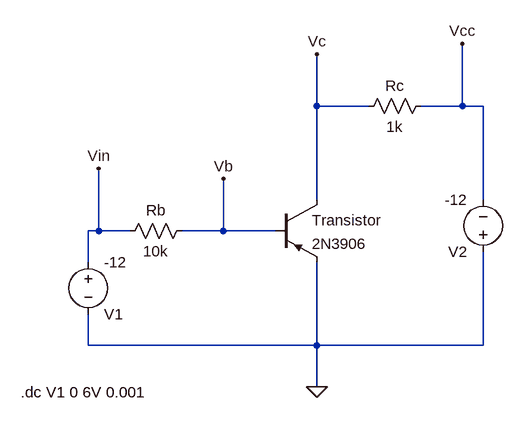
[diagram p0: schematic LED15mAPNP.asc]
LED15mAPNP.asc, the LTspice schematic file:
Version 4
SHEET 1 880 680
WIRE 48 -48 48 -128
WIRE 128 -48 48 -48
WIRE 272 -48 272 -144
WIRE 272 -48 208 -48
WIRE 304 -48 272 -48
WIRE 48 96 48 -48
WIRE 304 96 304 -48
WIRE -288 144 -288 48
WIRE -288 144 -304 144
WIRE -240 144 -288 144
WIRE -96 144 -96 64
WIRE -96 144 -160 144
WIRE -16 144 -96 144
WIRE -304 192 -304 144
WIRE -304 320 -304 272
WIRE 48 320 48 192
WIRE 48 320 -304 320
WIRE 304 320 304 176
WIRE 304 320 48 320
WIRE 48 384 48 320
FLAG 48 384 0
FLAG 48 -128 Vc
FLAG -96 64 Vb
FLAG -288 48 Vin
FLAG 272 -144 Vcc
SYMBOL pnp -16 96 R0
SYMATTR InstName Transistor
SYMATTR Value 2N3906
SYMBOL voltage 304 192 R180
WINDOW 123 0 0 Left 0
WINDOW 39 0 0 Left 0
SYMATTR InstName V2
SYMATTR Value -12
SYMBOL res 224 -64 R90
WINDOW 0 0 56 VBottom 2
WINDOW 3 32 56 VTop 2
SYMATTR InstName Rc
SYMATTR Value 1k
SYMBOL res -144 128 R90
WINDOW 0 0 56 VBottom 2
WINDOW 3 32 56 VTop 2
SYMATTR InstName Rb
SYMATTR Value 10k
SYMBOL voltage -304 176 R0
WINDOW 0 24 96 Left 2
WINDOW 3 24 16 Left 2
WINDOW 123 0 0 Left 0
WINDOW 39 0 0 Left 0
SYMATTR InstName V1
SYMATTR Value -12
TEXT -408 392 Left 2 !.dc V1 0 6V 0.001

The netlist it stands for:
* LED15mAPNP.asc
Q§Transistor Vc Vb 0 0 2N3906
V2 0 Vcc -12
Rc Vcc Vc 1k
Rb Vb Vin 10k
V1 Vin 0 -12
.model NPN NPN
.model PNP PNP
.lib standard.bjt
.dc V1 0 6V 0.001
.backanno
.end